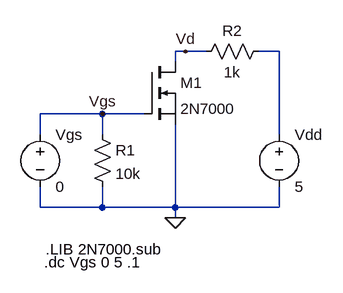
[diagram p0: schematic PreLab4.asc]
PreLab4.asc, the LTspice schematic file:
Version 4
SHEET 1 880 680
WIRE 320 -32 304 -32
WIRE 352 -32 320 -32
WIRE 464 -32 432 -32
WIRE 304 -16 304 -32
WIRE 192 64 96 64
WIRE 256 64 192 64
WIRE 96 96 96 64
WIRE 192 96 192 64
WIRE 464 96 464 -32
WIRE 96 208 96 176
WIRE 192 208 192 176
WIRE 192 208 96 208
WIRE 304 208 304 80
WIRE 304 208 192 208
WIRE 464 208 464 176
WIRE 464 208 304 208
WIRE 304 224 304 208
FLAG 304 224 0
FLAG 320 -32 Vd
FLAG 192 64 Vgs
SYMBOL voltage 96 80 R0
WINDOW 123 0 0 Left 0
WINDOW 39 0 0 Left 0
SYMATTR InstName Vgs
SYMATTR Value 0
SYMBOL voltage 464 80 R0
WINDOW 123 0 0 Left 0
WINDOW 39 0 0 Left 0
SYMATTR InstName Vdd
SYMATTR Value 5
SYMBOL res 176 80 R0
SYMATTR InstName R1
SYMATTR Value 10k
SYMBOL res 448 -48 R90
WINDOW 0 0 56 VBottom 2
WINDOW 3 32 56 VTop 2
SYMATTR InstName R2
SYMATTR Value 1k
SYMBOL nmos 256 -16 R0
SYMATTR InstName M1
SYMATTR Value 2N7000
TEXT 104 272 Left 2 !.LIB 2N7000.sub
TEXT 102 292 Left 2 !.dc Vgs 0 5 .1

The netlist it stands for:
* PreLab4.asc
Vgs Vgs 0 0
Vdd N001 0 5
R1 Vgs 0 10k
R2 N001 Vd 1k
M1 Vd Vgs 0 0 2N7000
.model NMOS NMOS
.model PMOS PMOS
.lib standard.mos
.LIB 2N7000.sub
.dc Vgs 0 5 .1
.backanno
.end